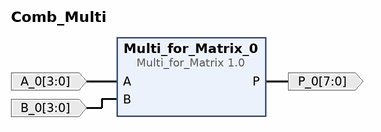
[diagram p0: block diagram of the top level]
# Vivado block design Comb_Multi, xc7a35tcpg236-2L, Vivado 2023.1
create_bd_design Comb_Multi

create_bd_port -dir I -from 3 -to 0 A_0
create_bd_port -dir I -from 3 -to 0 B_0
create_bd_port -dir O -from 7 -to 0 P_0

create_bd_cell -type ip -vlnv xilinx.com:user:Multi_for_Matrix:1.0 Multi_for_Matrix_0

# ---- connections ----

connect_bd_net -net A_0_1 [get_bd_ports A_0] [get_bd_pins Multi_for_Matrix_0/A]
connect_bd_net -net B_0_1 [get_bd_ports B_0] [get_bd_pins Multi_for_Matrix_0/B]
connect_bd_net [get_bd_pins Multi_for_Matrix_0/P] [get_bd_ports P_0]

validate_bd_design
save_bd_design
